# Altium project SimonDuino.PrjPcb
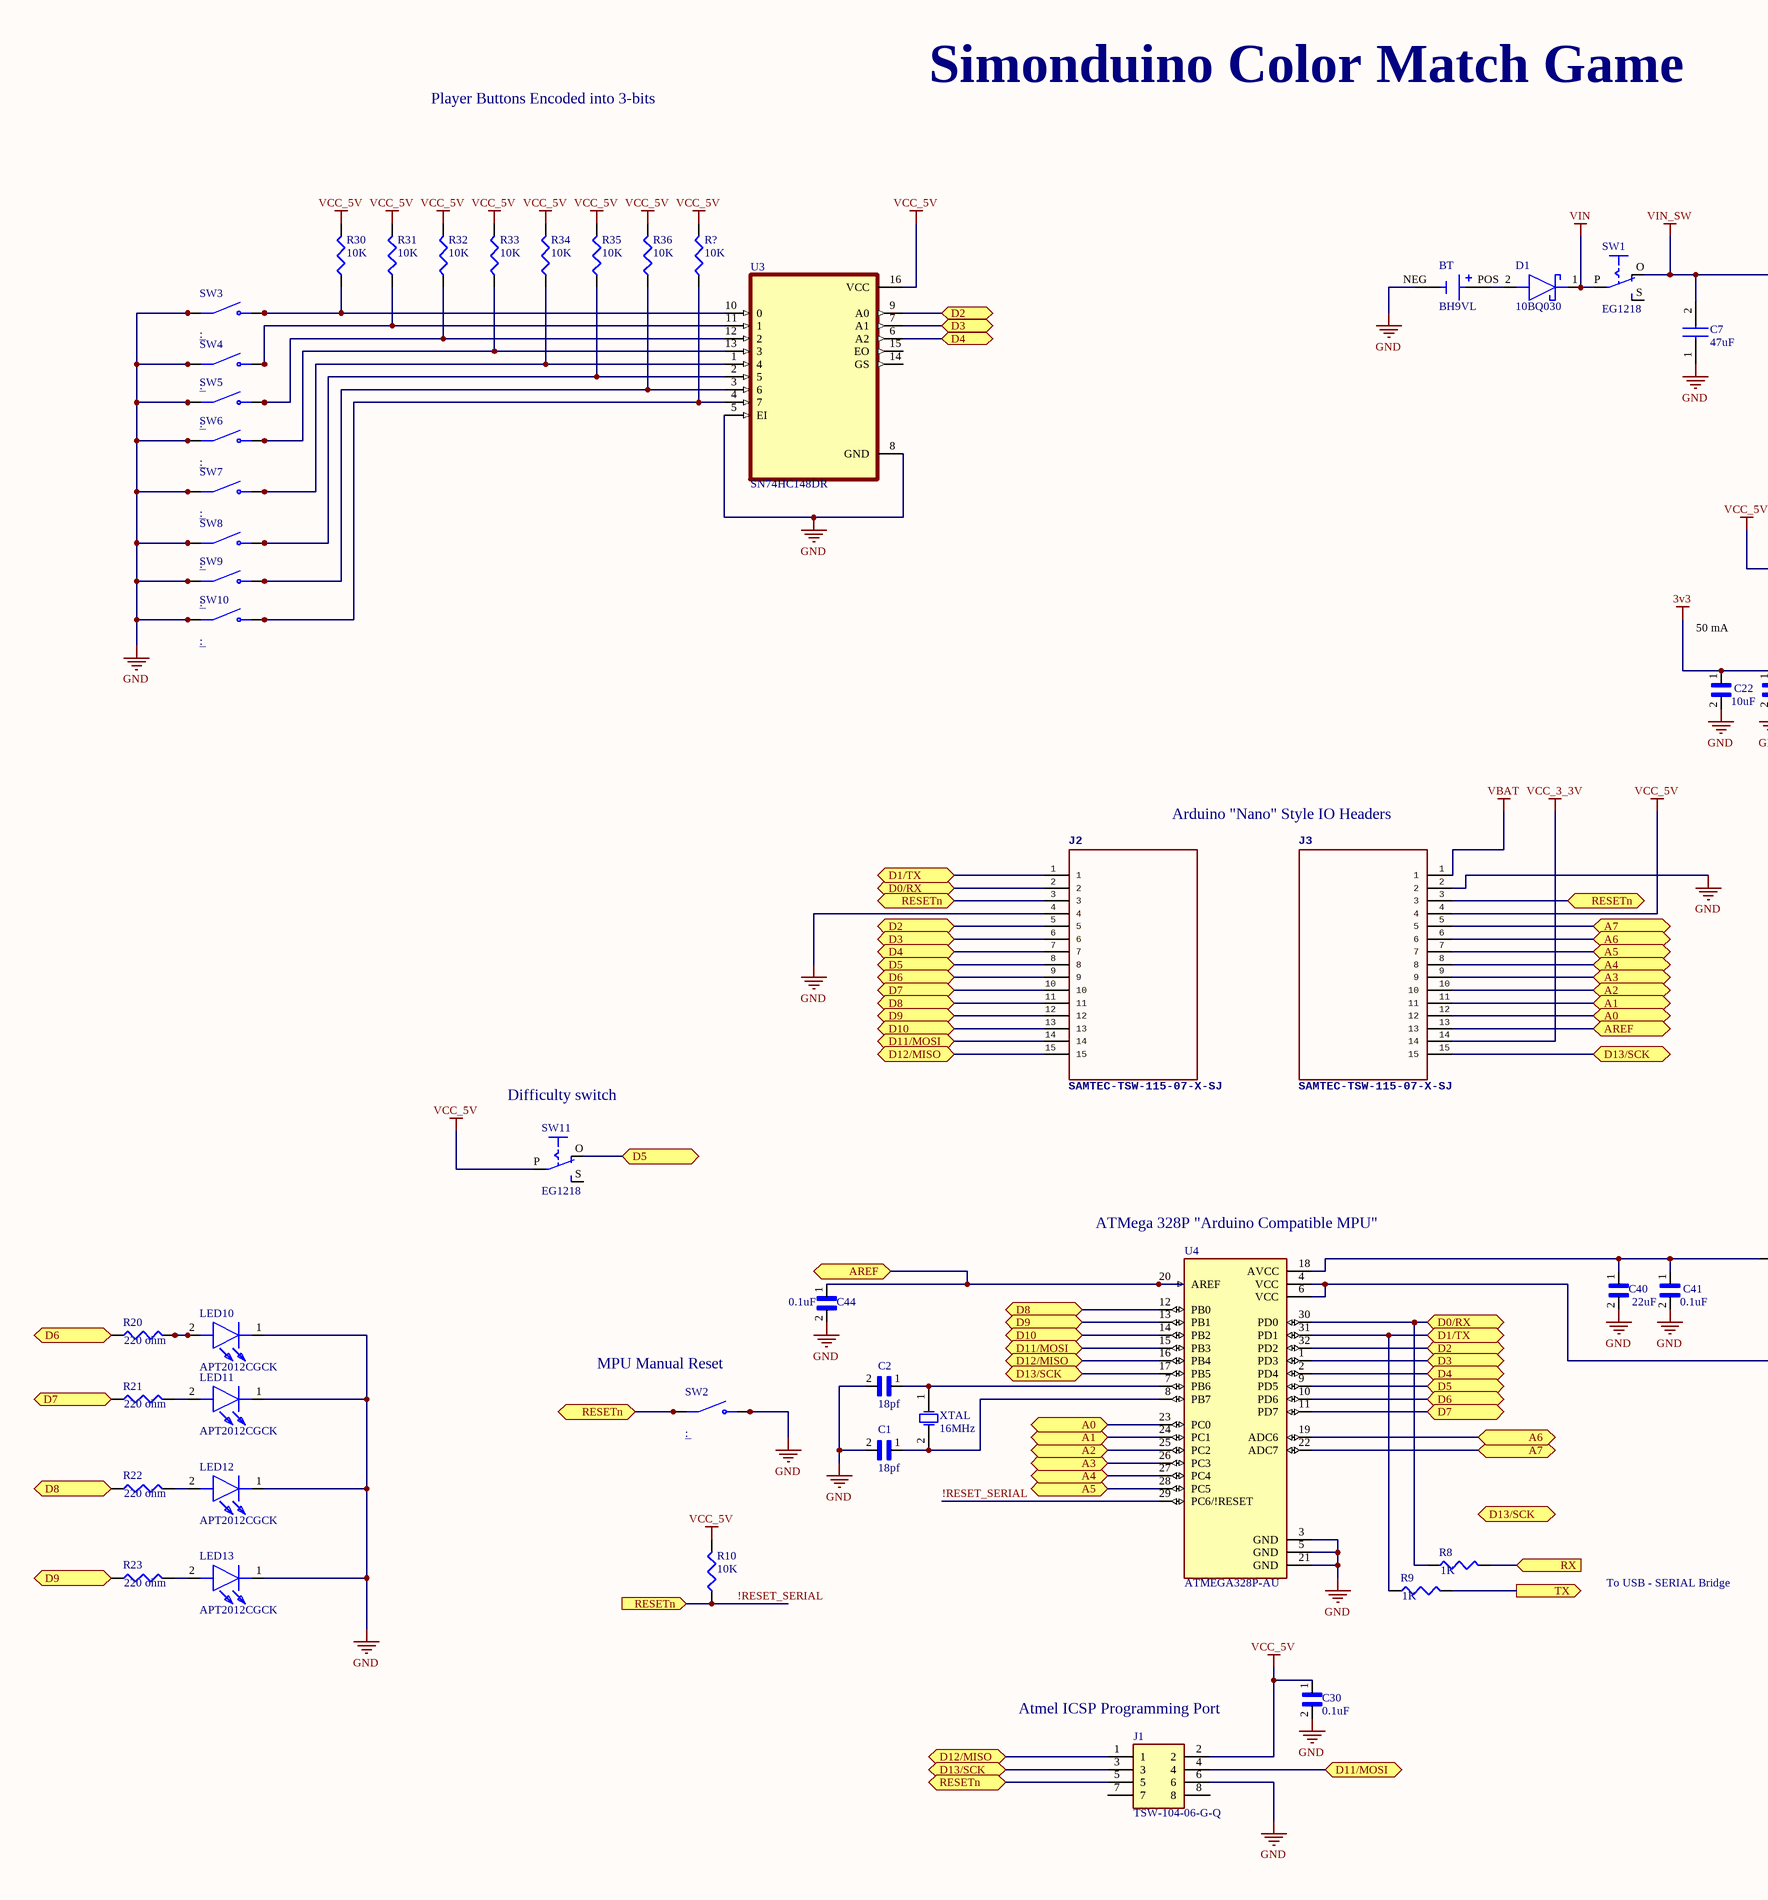
[diagram p0: SimonDuino.SchDoc, left]
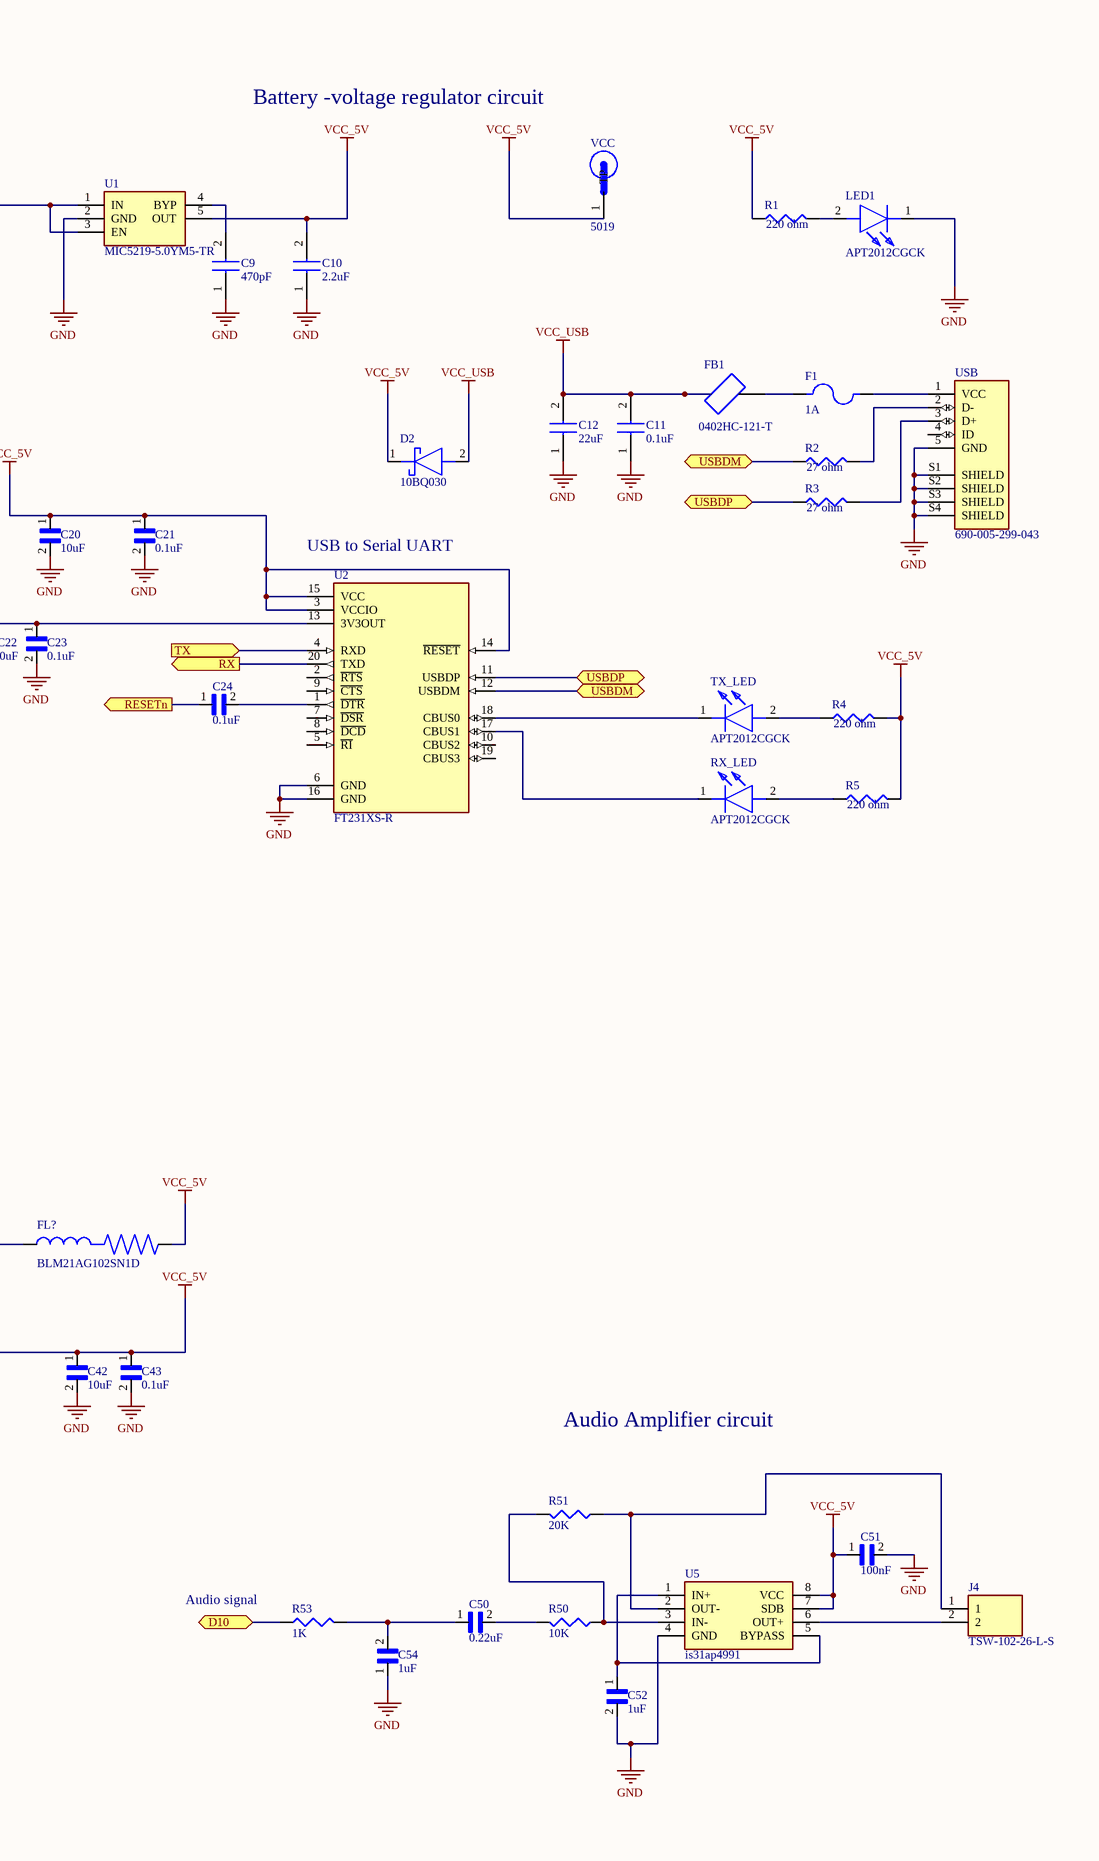
[diagram p1: SimonDuino.SchDoc, right]
1 sheet, 81 parts. Net scope: flat (ports and power ports of the same name join across sheets).
Board files: PCB1.PcbDoc, CCE_Simonduino_01.PcbDoc

## Sheet SimonDuino.SchDoc
size A2

### Parts
BT  BH9VL  [BAT_BH9VL]
C1  (no value)  [CAPC2012X140N]
C2  (no value)  [CAPC2012X140N]
C7  47uF  [CAPC2012X94N]
C9  470pF  [CAPC2012X94N]
C10  2.2uF  [CAPC2012X94N]
C11  0.1uF  [CAPC2012X94N]
C12  22uF  [CAPC2012X94N]
C20  (no value)  [CAPC2012X140N]
C21  (no value)  [CAPC2012X140N]
C22  (no value)  [CAPC2012X140N]
C23  (no value)  [CAPC2012X140N]
C24  (no value)  [CAPC2012X140N]
C30  (no value)  [CAPC2012X140N]
C40  (no value)  [CAPC2012X140N]
C41  (no value)  [CAPC2012X140N]
C42  (no value)  [CAPC2012X140N]
C43  (no value)  [CAPC2012X140N]
C44  (no value)  [CAPC2012X140N]
C50  (no value)  [CAPC2012X140N]
C51  (no value)  [CAPC2012X140N]
C52  (no value)  [CAPC2012X140N]
C54  (no value)  [CAPC2012X140N]
D1  10BQ030  [DIOM5336X240N]
D2  10BQ030  [DIOM5336X240N]
F1  1A  [FUSE_MF-NSML260/12-2]
FB1  0402HC-121-T  [BEADC1005X65N]
FL?  BLM21AG102SN1D  [BEADC2012X105N]
J1  TSW-104-06-G-Q  [HDRV8W64P508X254_2X4_1016X762X521P]
J2  SAMTEC-TSW-115-07-X-SJ  [SAMTEC-TSW-115-07-X-S]
J3  SAMTEC-TSW-115-07-X-SJ  [SAMTEC-TSW-115-07-X-S]
J4  TSW-102-26-L-S  [TSW-102-XX-YY-S]
LED1  APT2012CGCK  [LEDC2012X50N]
LED10  APT2012CGCK  [LEDC2012X50N]
LED11  APT2012CGCK  [LEDC2012X50N]
LED12  APT2012CGCK  [LEDC2012X50N]
LED13  APT2012CGCK  [LEDC2012X50N]
R1  value 220 ohm  [J1-0603]
R2  value 27 ohm  [J1-0603]
R3  value 27 ohm  [J1-0603]
R4  value 220 ohm  [J1-0603]
R5  value 220 ohm  [J1-0603]
R8  value 1K  [J1-0603]
R9  value 1K  [J1-0603]
R10  value 10K  [J1-0603]
R20  value 220 ohm  [J1-0603]
R21  value 220 ohm  [J1-0603]
R22  value 220 ohm  [J1-0603]
R23  value 220 ohm  [J1-0603]
R30  value 10K  [J1-0603]
R31  value 10K  [J1-0603]
R32  value 10K  [J1-0603]
R33  value 10K  [J1-0603]
R34  value 10K  [J1-0603]
R35  value 10K  [J1-0603]
R36  value 10K  [J1-0603]
R50  value 10K  [J1-0603]
R51  value 20K  [J1-0603]
R53  value 1K  [J1-0603]
R?  value 10K  [J1-0603]
RX_LED  APT2012CGCK  [LEDC2012X50N]
SW1  EG1218  [EG1218]
SW2  (no value)  [SW_4-1437565-9]
SW3  (no value)  [SW_4-1437565-9]
SW4  (no value)  [SW_4-1437565-9]
SW5  (no value)  [SW_4-1437565-9]
SW6  (no value)  [SW_4-1437565-9]
SW7  (no value)  [SW_4-1437565-9]
SW8  (no value)  [SW_4-1437565-9]
SW9  (no value)  [SW_4-1437565-9]
SW10  (no value)  [SW_4-1437565-9]
SW11  EG1218  [EG1218]
TX_LED  APT2012CGCK  [LEDC2012X50N]
U1  MIC5219-5.0YM5-TR  [SOT95P280X145-5N]
U2  FT231XS-R  [SOP63P599X175-20N]
U3  SN74HC148DR  [SOIC127P600X175-16N]
U4  ATMEGA328P-AU  [QFP80P900X900X120-32N]
U5  is31ap4991  [SOIC127P604X170-8N]
USB  690-005-299-043  [EDAC_690-005-299-043]
VCC  5019  [TP380X203]
XTAL  16MHz  [R38]

### Ports
A0 (bidir), A1 (bidir), A2 (bidir), A3 (bidir), A4 (bidir), A5 (bidir), A6 (bidir), A7 (bidir), AREF (bidir), D0/RX (bidir), D1/TX (bidir), D2 (bidir), D3 (bidir), D4 (bidir), D5 (bidir), D6 (bidir), D7 (bidir), D8 (bidir), D9 (bidir), D10 (bidir), D11/MOSI (bidir), D12/MISO (bidir), D13/SCK (bidir), RESETn (bidir), RESETn (in), RESETn (out), RX (in), RX (out), TX (in), TX (out), USBDM (bidir), USBDP (bidir)

### Nets
3v3: C22.1 C23.1 U2.13(3V3OUT)
GND: BT.NEG C1.2 C2.2 C7.1 C9.1 C10.1 C11.1 C12.1 C20.2 C21.2 C22.2 C23.2 C30.2 C40.2 C41.2 C42.2 C43.2 C44.2 C51.2 C52.2 C54.1 J1.6 J2.4 J3.2 LED1.1(K) LED10.1(K) LED11.1(K) LED12.1(K) LED13.1(K) SW2.3(NO) SW2.4(NO) SW3.1(COM) SW3.2(COM) SW4.1(COM) SW4.2(COM) SW5.1(COM) SW5.2(COM) SW6.1(COM) SW6.2(COM) SW7.1(COM) SW7.2(COM) SW8.1(COM) SW8.2(COM) SW9.1(COM) SW9.2(COM) SW10.1(COM) SW10.2(COM) U1.2(GND) U2.6(GND) U2.16(GND) U3.5(EI) U3.8(GND) U4.3(GND) U4.5(GND) U4.21(GND) U5.4(GND) USB.5(GND) USB.S1(SHIELD) USB.S2(SHIELD) USB.S3(SHIELD) USB.S4(SHIELD)
VBAT: J3.1
VCC_3_3V: J3.14
VCC_5V: C10.2 C20.1 C21.1 C30.1 C42.1 C43.1 C51.1 D2.1(K) FL?.2 J1.2 J3.4 R1.1 R4.2 R5.2 R10.2 R30.2 R31.2 R32.2 R33.2 R34.2 R35.2 R36.2 R?.2 SW11.P U1.5(OUT) U2.3(VCCIO) U2.14(~{RESET}) U2.15(VCC) U3.16(VCC) U4.4(VCC) U4.6(VCC) U5.7(SDB) U5.8(VCC) VCC.1(TP)
VCC_USB: C11.2 C12.2 D2.2(A) FB1.1
VIN: D1.1(K) SW1.P
VIN_SW: C7.2 SW1.O U1.1(IN) U1.3(EN)
!RESET_SERIAL: C24.1 J1.5 J2.3 J3.3 R10.1 SW2.1(COM) SW2.2(COM) U4.29(PC6/!RESET) ; port RESETn
NetBT_POS: BT.POS D1.2(A)
NetC1_1: C1.1 U4.8(PB7) XTAL.2(OSC2)
NetC2_1: C2.1 U4.7(PB6) XTAL.1(OSC1)
NetC9_2: C9.2 U1.4(BYP)
NetC24_2: C24.2 U2.1(~{DTR})
NetC40_1: C40.1 C41.1 FL?.1 U4.18(AVCC)
NetC44_1: C44.1 J3.13 U4.20(AREF) ; port AREF
NetC50_1: C50.1 C54.2 R53.2
NetC50_2: C50.2 R50.2
NetC52_1: C52.1 U5.1(IN+) U5.5(BYPASS)
NetF1_1: F1.1 FB1.2
NetF1_2: F1.2 USB.1(VCC)
NetJ1_1: J1.1 J2.15 U4.16(PB4) ; port D12/MISO
NetJ1_3: J1.3 J3.15 U4.17(PB5) ; port D13/SCK
NetJ1_4: J1.4 J2.14 U4.15(PB3) ; port D11/MOSI
NetJ2_1: J2.1 R9.1 U4.31(PD1) ; port D1/TX
NetJ2_2: J2.2 R8.1 U4.30(PD0) ; port D0/RX
NetJ2_5: J2.5 U3.9(A0) U4.32(PD2) ; port D2
NetJ2_6: J2.6 U3.7(A1) U4.1(PD3) ; port D3
NetJ2_7: J2.7 U3.6(A2) U4.2(PD4) ; port D4
NetJ2_8: J2.8 SW11.O U4.9(PD5) ; port D5
NetJ2_9: J2.9 R20.1 U4.10(PD6) ; port D6
NetJ2_10: J2.10 R21.1 U4.11(PD7) ; port D7
NetJ2_11: J2.11 R22.1 U4.12(PB0) ; port D8
NetJ2_12: J2.12 R23.1 U4.13(PB1) ; port D9
NetJ2_13: J2.13 R53.1 U4.14(PB2) ; port D10
NetJ3_5: J3.5 U4.22(ADC7) ; port A7
NetJ3_6: J3.6 U4.19(ADC6) ; port A6
NetJ3_7: J3.7 U4.28(PC5) ; port A5
NetJ3_8: J3.8 U4.27(PC4) ; port A4
NetJ3_9: J3.9 U4.26(PC3) ; port A3
NetJ3_10: J3.10 U4.25(PC2) ; port A2
NetJ3_11: J3.11 U4.24(PC1) ; port A1
NetJ3_12: J3.12 U4.23(PC0) ; port A0
NetJ4_1: J4.1 R51.1 U5.2(OUT-)
NetJ4_2: J4.2 U5.6(OUT+)
NetLED1_2: LED1.2(A) R1.2
NetLED10_2: LED10.2(A) R20.2
NetLED11_2: LED11.2(A) R21.2
NetLED12_2: LED12.2(A) R22.2
NetLED13_2: LED13.2(A) R23.2
NetR2_1: R2.1 U2.12(USBDM) ; port USBDM
NetR2_2: R2.2 USB.2(D-)
NetR3_1: R3.1 U2.11(USBDP) ; port USBDP
NetR3_2: R3.2 USB.3(D+)
NetR4_1: R4.1 TX_LED.2(A)
NetR5_1: R5.1 RX_LED.2(A)
NetR8_2: R8.2 U2.20(TXD) ; port RX
NetR9_2: R9.2 U2.4(RXD) ; port TX
NetR30_1: R30.1 SW3.3(NO) SW3.4(NO) U3.10(0)
NetR31_1: R31.1 SW4.3(NO) SW4.4(NO) U3.11(1)
NetR32_1: R32.1 SW5.3(NO) SW5.4(NO) U3.12(2)
NetR33_1: R33.1 SW6.3(NO) SW6.4(NO) U3.13(3)
NetR34_1: R34.1 SW7.3(NO) SW7.4(NO) U3.1(4)
NetR35_1: R35.1 SW8.3(NO) SW8.4(NO) U3.2(5)
NetR36_1: R36.1 SW9.3(NO) SW9.4(NO) U3.3(6)
NetR50_1: R50.1 R51.2 U5.3(IN-)
NetR?_1: R?.1 SW10.3(NO) SW10.4(NO) U3.4(7)
NetRX_LED_1: RX_LED.1(K) U2.17(CBUS1)
NetTX_LED_1: TX_LED.1(K) U2.18(CBUS0)

Not connected (* = marked no-connect by the designer): J1 7 8; SW1 S; SW11 S; U2 2(~{RTS}) 5(~{RI}) 7(~{DSR}) 8(~{DCD}) 9(~{CTS}) 10(CBUS2) 19(CBUS3); U3 14(GS) 15(EO); USB 4(ID)

### Notes on the sheet
- Player Buttons Encoded into 3-bits
- Simonduino Color Match Game
- Battery -voltage regulator circuit
- 50 mA
- (near U2) USB to Serial UART
- Arduino "Nano" Style IO Headers
- Difficulty switch
- (near U4) ATMega 328P "Arduino Compatible MPU"
- (near SW2) MPU Manual Reset
- Audio Amplifier circuit
- To USB - SERIAL Bridge
- (near R53) Audio signal
- (near J1) Atmel ICSP Programming Port
- Title
- Size:
- Date:
- File:
- A2
- Number:
- Time:
- Revision:
- Sheet
- of
- (in symbol 08055K220JBTTR) 18pf; 22uF; 0.1uF; 10uF; 0.22uF; 1uF; 100nF

### Library data of the parts
BT = BH9VL: Battery Holder _Open_ 9V 1 Cell Solder Lug; MF: MPD; Availability: Unavailable; MP: BH9VL; Price: None; Value: *; SnapEDA_Link: https://www.snapeda.com/parts/BH9VL/MPD/view-part/4480504/?ref=snap; Package: None
C1 C2 C20-C24 C30 C40-C44 C50-C52 C54 = 08055K220JBTTR: 50V 0805; MF: AVX; SnapEDA_Link: https://www.snapeda.com/parts/08055K220JBTTR/AVX/view-part/1984650/?ref=snap; Value: *; MP: 08055K220JBTTR; Price: None; Availability: Unavailable; Package: 0805 AVX
C7 C9-C12 = 08055A471KAT2A: Capacitor; Manufacturer_Name: AVX; Datasheet Link: https://componentsearchengine.com/Datasheets/1/06031A100FAT2A.pdf; Height: 0.94mm; Manufacturer_Part_Number: 08055A471KAT2A; Mouser Part Number: 581-08055A471K; Mouser Price/Stock: https://www.mouser.com/Search/Refine.aspx?Keyword=581-08055A471K
D1 D2 = 10BQ030: Schottky Diode; Manufacturer_Name: Vishay; Datasheet Link: http://media.digikey.com/pdf/Data%20Sheets/Vishay%20Semiconductors/VS-10BQ030PbF.pdf; Height: 2.4mm; Manufacturer_Part_Number: 10BQ030; Mouser Part Number: 844-10BQ030; Mouser Price/Stock: https://www.mouser.co.uk/ProductDetail/Vishay-Semiconductors/10BQ030?qs=ZnkiQKk%252B7g%252Bc2Y2efnU%2FTw%3D%3D
F1 = MF-NSML260/12-2: Polymeric PTC Resettable Fuse 12V 2.6A Ih Surface Mount 1206 (3216 Metric), Concave; MF: Bourns Inc.; Check_prices: https://www.snapeda.com/parts/MF-NSML260/12-2/Bourns/view-part/6238260/?ref=eda; Package: None; MP: MF-NSML260/12-2; Value: *; Availability: In Stock; SnapEDA_Link: https://www.snapeda.com/parts/MF-NSML260/12-2/Bourns/view-part/6238260/?ref=snap; Price: None
FB1 = ACML-0402HC-121-T: 120 Ohms @ 100MHz 1 Ferrite Bead 0402 (1005 Metric) 1.2A 100mOhm; MF: Abracon; Price: None; Purchase-URL: https://pricing.snapeda.com/search/part/ACML-0402HC-121-T/?ref=eda; Package: 0402 Abracon; Check_prices: https://www.snapeda.com/parts/ACML-0402HC-121-T/Abracon/view-part/2730903/?ref=eda; Availability: Good; MP: ACML-0402HC-121-T; Value: *; SnapEDA_Link: https://www.snapeda.com/parts/ACML-0402HC-121-T/Abracon/view-part/2730903/?ref=snap
FL? = BLM21AG102SN1D: 1 kOhms @ 100MHz 1 Ferrite Bead 0805 _2012 Metric_ 500mA 280mOhm; MF: Murata Electronics; SnapEDA_Link: https://www.snapeda.com/parts/BLM21AG102SN1D/Murata/view-part/287205/?ref=snap; Value: *; Availability: Unavailable; MP: BLM21AG102SN1D; Price: None; Package: 2012 Murata
J1 = TSW-104-06-G-Q: Connector; Manufacturer_Name: SAMTEC; Datasheet Link: http://suddendocs.samtec.com/catalog_english/tsw_th.pdf; Height: 5.21mm; Manufacturer_Part_Number: TSW-104-06-G-Q; Mouser Part Number: 200-TSW10406GQ; Mouser Price/Stock: https://www.mouser.co.uk/ProductDetail/Samtec/TSW-104-06-G-Q?qs=%252BZP6%2F%252BtExtDsOB%252B%252BC1UWdg%3D%3D
J4 = TSW-102-26-L-S: Connector; Manufacturer_Name: SAMTEC; Datasheet Link: http://suddendocs.samtec.com/prints/tsw-xxx-xx-xxx-x-xx-xxx-mkt.pdf; Manufacturer_Part_Number: TSW-102-26-L-S; Mouser Part Number: 200-TSW10226LS; Mouser Price/Stock: https://www.mouser.com/Search/Refine.aspx?Keyword=200-TSW10226LS; Arrow Part Number: TSW-102-26-L-S; Arrow Price/Stock: https://www.arrow.com/en/products/tsw-102-26-l-s/samtec
LED1 LED10-LED13 RX_LED TX_LED = APT2012CGCK: LED; Manufacturer_Name: Kingbright; Datasheet Link: https://componentsearchengine.com/Datasheets/1/APT2012CGCK.pdf; Height: 0.5mm; Manufacturer_Part_Number: APT2012CGCK; Mouser Part Number: 604-APT2012CGCK; Mouser Price/Stock: https://www.mouser.co.uk/ProductDetail/Kingbright/APT2012CGCK?qs=VdjlWU%2FzoOEv1TxC2gMNzg%3D%3D; Arrow Part Number: APT2012CGCK; Arrow Price/Stock: https://www.arrow.com/en/products/apt2012cgck/kingbright
R1-R5 R8-R10 R20-R23 R30-R36 R50 R51 R53 R? = Res3: Resistor; Published: 8-Jun-2000; LatestRevisionDate: 29-May-2009; LatestRevisionNote: IPC-7351 Footprint Added.; PackageReference: J1-0603; Publisher: Altium Limited; PackageDescription: Chip Resistor
SW1 SW11 = EG1218: æ»‘å‹•é–‹é—œSPDTé€šå­”; MF: E-Switch; Package: Custom package E-Switch; Price: None; MP: EG1218; Availability: Unavailable; Value: *; SnapEDA_Link: https://www.snapeda.com/parts/EG1218/E-Switch/view-part/13895/?ref=snap
SW2-SW10 = 4-1437565-9: Tactile Switch SPST-NO Top Actuated Surface Mount; Configuration_Pole-Throw: Single Pole - Single Throw; Contact_Current_Rating: 50 mA; MF: TE Connectivity; Availability: Warning; Value: *; Package: None; Price: None; SnapEDA_Link: https://www.snapeda.com/parts/4-1437565-9/TE%20Connectivity%20ALCOSWITCH%20Switches/view-part/304397/?ref=snap; Purchase-URL: https://pricing.snapeda.com/search/part/4-1437565-9/?ref=eda; MP: 4-1437565-9; EU_RoHS_Compliance: Compliant
U1 = MIC5219-5.0YM5-TR: Integrated Circuit; Manufacturer_Name: Microchip; Datasheet Link: http://ww1.microchip.com/downloads/en/DeviceDoc/MIC5219-500mA-Peak-Output-LDO-Regulator-DS20006021A.pdf; Height: 1.45mm; Manufacturer_Part_Number: MIC5219-5.0YM5-TR; Mouser Part Number: 998-MIC5219-5.0YM5TR; Mouser Price/Stock: https://www.mouser.co.uk/ProductDetail/Microchip-Technology-Micrel/MIC5219-50YM5-TR?qs=U6T8BxXiZAXThrqii9sAvA%3D%3D; Arrow Part Number: MIC5219-5.0YM5-TR; Arrow Price/Stock: https://www.arrow.com/en/products/mic5219-5.0ym5-tr/microchip-technology?region=nac
U2 = FT231XS-R: USB Bridge, USB to UART USB 2.0 UART Interface 20-SSOP; MF: FTDI,; Price: None; Package: SSOP-20 FTDI; Value: *; MP: FT231XS-R; Availability: Unavailable; SnapEDA_Link: https://www.snapeda.com/parts/FT231XS-R/FTDI%2C%20Future%20Technology%20Devices%20International%20Ltd/view-part/48872/?ref=snap
U4 = ATMEGA328P-AU: AVR AVRÂ® ATmega Microcontroller IC 8-Bit 20MHz 32KB _16K x 16_ FLASH 32-TQFP _7x7_; MF: Microchip; Value: *; SnapEDA_Link: https://www.snapeda.com/parts/ATMEGA328P-AU/Microchip/view-part/44280/?ref=snap; MP: ATMEGA328P-AU; Availability: Unavailable; Price: None; Package: TQFP-32 Microchip
U5 = is31ap4991: Integrated Circuit; Manufacturer_Name: Lumissil Microsystems; Height: 1.7mm; Manufacturer_Part_Number: is31ap4991
USB = 690-005-299-043: USB - mini B USB 2.0 Receptacle Connector 5 Position Surface Mount, Right Angle; MF: EDAC Inc.; Price: None; Purchase-URL: https://pricing.snapeda.com/search/part/690-005-299-043/?ref=eda; Check_prices: https://www.snapeda.com/parts/690-005-299-043/EDAC%20Inc./view-part/347309/?ref=eda; Value: *; SnapEDA_Link: https://www.snapeda.com/parts/690-005-299-043/EDAC%20Inc./view-part/347309/?ref=snap; Availability: Good; MP: 690-005-299-043; Package: None
VCC = 5019: PC Test Point, Miniature Phosphor Bronze, Silver Plating Surface Mount Mounting Type; MF: Keystone Electronics; Value: *; MP: 5019; Package: 2010 Keystone; SnapEDA_Link: https://www.snapeda.com/parts/5019/Keystone%20Electronics/view-part/449144/?ref=snap; Digi-Key_Part_Number: 36-5019CT-ND; Digi-Key_Purchase_URL: https://www.digikey.com/product-detail/en/keystone-electronics/5019/36-5019CT-ND/3907344?utm_source=snapeda&utm_medium=aggregator&utm_campaign=symbol
XTAL = XTAL: Crystal Oscillator; Published: 8-Jun-2000; LatestRevisionDate: 17-Jul-2002; LatestRevisionNote: Re-released for DXP Platform.; PackageReference: R38; Publisher: Altium Limited; PackageDescription: Crystal, Thru-Hole; 2 Leads; Body 3.1 x 8.2 mm (Dia.xH)
U3 = SN74HC148DR: Package: None; Price: None; Value: *; MP: SN74HC148DR; Availability: Unavailable